# Altium schematic sheet 1V2 Buck Converter.SchDoc: LM27403 1.2V Buck Converter
size Letter; SheetNumber: 3; SheetTotal: 18
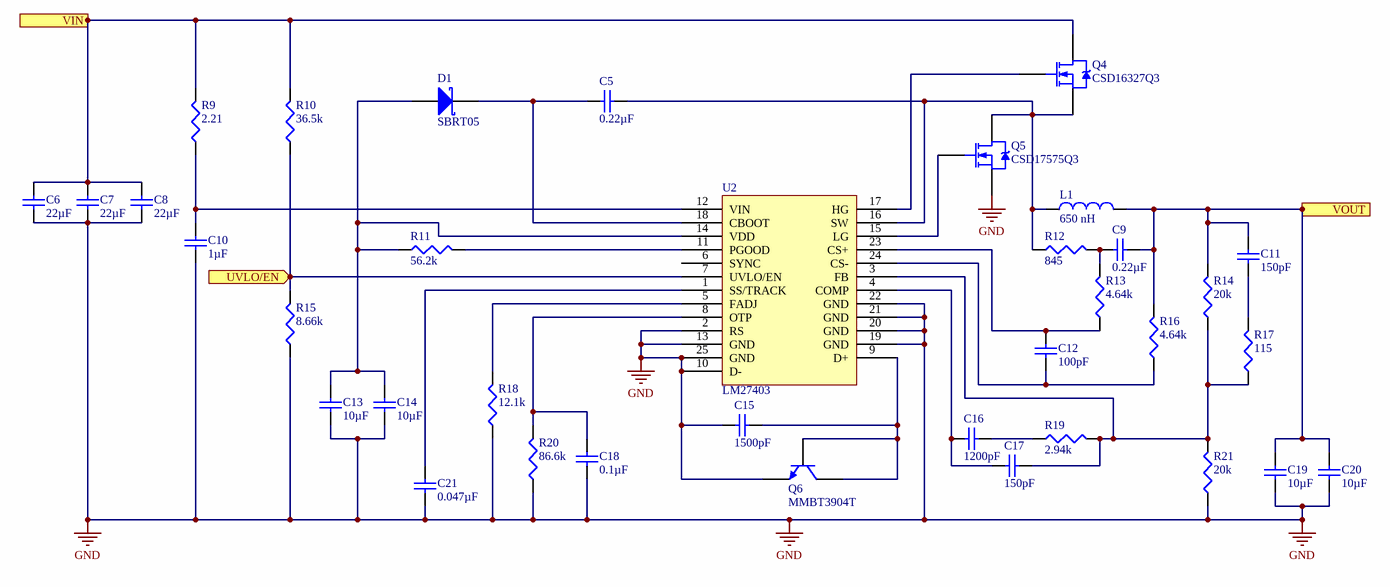
[diagram p0: 1V2 Buck Converter.SchDoc]

## Parts
C5  value 0.22µF  [TY-0402V]  (hidden comment: Cap)
C6  value 22µF  [TY-1210M]  (hidden comment: Cap)
C7  value 22µF  [TY-1210M]  (hidden comment: Cap)
C8  value 22µF  [TY-1210M]  (hidden comment: Cap)
C9  value 0.22µF  [TY-0402V]  (hidden comment: Cap)
C10  value 1µF  [TY-0402V]  (hidden comment: Cap)
C11  value 150pF  [TDK-CGA2B]  (hidden comment: Cap)
C12  value 100pF  [TDK-CGA2B]  (hidden comment: Cap)
C13  value 10µF  [TY-0603A]  (hidden comment: Cap)
C14  value 10µF  [TY-0603A]  (hidden comment: Cap)
C15  value 1500pF  [TDK-CGA2B]  (hidden comment: Cap)
C16  value 1200pF  [KEM-0402BB]  (hidden comment: Cap)
C17  value 150pF  [TDK-CGA2B]  (hidden comment: Cap)
C18  value 0.1µF  [TDK-CGA2B]  (hidden comment: Cap)
C19  value 10µF  [TY-1210M]  (hidden comment: Cap)
C20  value 10µF  [TY-1210M]  (hidden comment: Cap)
C21  value 0.047µF  [TDK-CGA2B]  (hidden comment: Cap)
D1  SBRT05  [DIOD-X2-DFN1006-2]
L1  value 650 nH  [CCI-XAL7070]  (hidden comment: XAL7070-651MEC)
Q4  CSD16327Q3  [TI-Q3]
Q5  CSD17575Q3  [TI-Q3]
Q6  MMBT3904T  [SOT523]
R9  value 2.21  [VSH-0402MCS]  (hidden comment: Res3)
R10  value 36.5k  [PANA-ERA2A]  (hidden comment: Res3)
R11  value 56.2k  [PANA-ERA2A]  (hidden comment: Res3)
R12  value 845  [PANA-ERA2A]  (hidden comment: Res3)
R13  value 4.64k  [PANA-ERJ2R]  (hidden comment: Res3)
R14  value 20k  [PANA-ERJ2R]  (hidden comment: Res3)
R15  value 8.66k  [PANA-ERA2A]  (hidden comment: Res3)
R16  value 4.64k  [PANA-ERJ2R]  (hidden comment: Res3)
R17  value 115  [PANA-ERA2A]  (hidden comment: Res3)
R18  value 12.1k  [PANA-ERA2A]  (hidden comment: Res3)
R19  value 2.94k  [PANA-ERA2A]  (hidden comment: Res3)
R20  value 86.6k  [PANA-ERA2A]  (hidden comment: Res3)
R21  value 20k  [PANA-ERJ2R]  (hidden comment: Res3)
U2  LM27403  [TI-RTW0024A]

## Ports
UVLO/EN (in), VIN (in), VOUT (out)

## Nets
GND: C6.1 C7.1 C8.1 C10.1 C13.1 C14.1 C15.1 C18.1 C19.1 C20.1 C21.1 Q5.3(S) Q6.1(E) R15.1 R18.1 R20.1 R21.1 U2.2(RS) U2.10(D-) U2.13(GND) U2.19(GND) U2.20(GND) U2.21(GND) U2.22(GND) U2.25(GND)
UVLO/EN: R10.1 R15.2 U2.7(UVLO/EN) ; port UVLO/EN
VIN: C6.2 C7.2 C8.2 Q4.2(D) R9.2 R10.2 ; port VIN
VOUT: C9.2 C11.2 C19.2 C20.2 L1.2 R14.2 R16.2 ; port VOUT
NetC5_1: C5.1 D1.2(K) U2.18(CBOOT)
NetC5_2: C5.2 L1.1 Q4.3(S) Q5.2(D) R12.1 U2.16(SW)
NetC9_1: C9.1 R12.2 R13.2
NetC10_2: C10.2 R9.1 U2.12(VIN)
NetC11_1: C11.1 R17.2
NetC12_1: C12.1 R16.1 U2.24(CS-)
NetC12_2: C12.2 R13.1 U2.23(CS+)
NetC13_2: C13.2 C14.2 D1.1(A) R11.1 U2.14(VDD)
NetC15_2: C15.2 Q6.2(B) Q6.3(C) U2.9(D+)
NetC16_1: C16.1 C17.1 U2.4(COMP)
NetC16_2: C16.2 R19.1
NetC17_2: C17.2 R14.1 R17.1 R19.2 R21.2 U2.3(FB)
NetC18_2: C18.2 R20.2 U2.8(OTP)
NetC21_2: C21.2 U2.1(SS/TRACK)
NetQ4_1: Q4.1(G) U2.17(HG)
NetQ5_1: Q5.1(G) U2.15(LG)
NetR11_2: R11.2 U2.11(PGOOD)
NetR18_2: R18.2 U2.5(FADJ)

Not connected (* = marked no-connect by the designer): U2 6(SYNC)

## Notes on the sheet
- (the "License"); you may not use or redistribute this file except in compliance with the License. You
- This file and the information within it are licensed under the terms of the Apache License, Version 2.0
- Copyright
- Unless required by applicable law or agreed to in writing, content distributed under the License is
- distributed on an "AS IS" BASIS, WITHOUT WARRANTIES OR CONDITIONS OF ANY KIND,
- either express or implied. See the License for the specific language governing permissions and
- limitations under the License.
- may obtain a copy of the License at:
- http://www.apache.org/licenses/LICENSE-2.0
- Title
- Size:
- Date:
- Letter
- Number:
- Time:
- Revision:
- Sheet
- of
- University of Alberta
- Deptartment of Electrical
- and Computer Engineering
- Edmonton AB, Canada
- T6G 1H9
- File:

## Library data of the parts
C5 C9 = PC-TY-00301: CAP CER 0.22UF 50V X5R 0402; Manufacturer Part Number: UMK105BJ224KV-F; Index: 301; Designator: C?; Tolerance: ±10%; Published: 2016-03-13; LatestRevisionDate: 2016-03-13; LatestRevisionNote: ...; PackageReference: 0402 (1005 Metric); Publisher: AlbertaSat; PackageDescription: Chip Capacitor, 2-Leads, Body 1.00x0.50mm, IPC Low Density; Part Number: PC-TY-00301; Supplier Part Number 1: 587-3500-1-ND; Supplier 1: Digi-key; Supplier Link: http://www.digikey.ca/product-search/en?keywords=587-3500-1-ND; Voltage-Rated: 50V; Temperature Coefficient: X5R; Application: General Purpose
C6-C8 = PC-TY-00742: CAP CER 22UF 25V X7R 1210; Manufacturer Part Number: TMK325B7226MM-TR; Index: 742; Designator: C?; Tolerance: ±20%; Published: 2016-03-13; LatestRevisionDate: 2016-03-13; LatestRevisionNote: ...; PackageReference: 1210 (3225 Metric); Publisher: AlbertaSat; PackageDescription: Chip Capacitor, 2-Leads, Body 3.20x2.50mm, IPC Low Density; Part Number: PC-TY-00742; Supplier Part Number 1: 587-2784-1-ND; Supplier 1: Digi-key; Supplier Link: http://www.digikey.ca/product-search/en?keywords=587-2784-1-ND; Voltage-Rated: 25V; Temperature Coefficient: X7R; Application: General Purpose
C10 = PC-TY-00381: CAP CER 1UF 25V X5R 0402; Manufacturer Part Number: TMK105BJ105MV-F; Index: 381; Designator: C?; Tolerance: ±20%; Published: 2016-03-13; LatestRevisionDate: 2016-03-13; LatestRevisionNote: ...; PackageReference: 0402 (1005 Metric); Publisher: AlbertaSat; PackageDescription: Chip Capacitor, 2-Leads, Body 1.00x0.50mm, IPC Low Density; Part Number: PC-TY-00381; Supplier Part Number 1: 587-3245-1-ND; Supplier 1: Digi-key; Supplier Link: http://www.digikey.ca/product-search/en?keywords=587-3245-1-ND; Voltage-Rated: 25V; Temperature Coefficient: X5R; Application: General Purpose
C11 C17 = PC-TDK-01264: CAP CER 150PF 50V C0G 0402; Manufacturer Part Number: CGA2B2C0G1H151J050BA; Index: 1264; Designator: C?; Tolerance: ±5%; Temperature Coefficient: NP0; Published: 2016-03-16; LatestRevisionDate: 2016-03-16; LatestRevisionNote: ...; PackageReference: 0402 (1005 Metric); Publisher: AlbertaSat; PackageDescription: Radial Cap, Thru-Hole; 2 Leads; 0.3 in Pin Spacing; Part Number: PC-TDK-01264; Supplier Part Number 1: 445-5598-1-ND; Supplier 1: Digi-key; Supplier Link: http://www.digikey.ca/product-search/en?keywords=445-5598-1-ND; Voltage - Rated: 50V; Applications: Automotive
C12 = PC-TDK-01227: CAP CER 100PF 50V C0G 0402; Manufacturer Part Number: CGA2B2C0G1H101J050BA; Index: 1227; Designator: C?; Tolerance: ±5%; Temperature Coefficient: NP0; Published: 2016-03-16; LatestRevisionDate: 2016-03-16; LatestRevisionNote: ...; PackageReference: 0402 (1005 Metric); Publisher: AlbertaSat; PackageDescription: Radial Cap, Thru-Hole; 2 Leads; 0.3 in Pin Spacing; Part Number: PC-TDK-01227; Supplier Part Number 1: 445-5596-1-ND; Supplier 1: Digi-key; Supplier Link: http://www.digikey.ca/product-search/en?keywords=445-5596-1-ND; Voltage - Rated: 50V; Applications: Automotive
C13 C14 = PC-TY-00593: CAP CER 10UF 16V X5R 0603; Manufacturer Part Number: EMK107BBJ106MA-T; Index: 593; Designator: C?; Tolerance: ±20%; Published: 2016-03-13; LatestRevisionDate: 2016-03-13; LatestRevisionNote: ...; PackageReference: 0603 (1608 Metric); Publisher: AlbertaSat; PackageDescription: Chip Capacitor, 2-Leads, Body 1.60x0.80mm, IPC Low Density; Part Number: PC-TY-00593; Supplier Part Number 1: 587-3238-1-ND; Supplier 1: Digi-key; Supplier Link: http://www.digikey.ca/product-search/en?keywords=587-3238-1-ND; Voltage-Rated: 16V; Temperature Coefficient: X5R; Application: General Purpose
C15 = PC-TDK-01528: CAP CER 1500PF 50V X8R 0402; Manufacturer Part Number: CGA2B2X8R1H152K050BA; Index: 1528; Designator: C?; Tolerance: ±10%; Published: 2016-03-16; LatestRevisionDate: 2016-03-16; LatestRevisionNote: ...; PackageReference: 0402 (1005 Metric); Publisher: AlbertaSat; PackageDescription: Radial Cap, Thru-Hole; 2 Leads; 0.3 in Pin Spacing; Part Number: PC-TDK-01528; Supplier Part Number 1: 445-5880-1-ND; Supplier 1: Digi-key; Supplier Link: http://www.digikey.ca/product-search/en?keywords=445-5880-1-ND; Voltage - Rated: 50V; Temperature Coefficient: X8R; Applications: Automotive
C16 = PC-KEM-01136: CAP CER 1200PF 50V NP0 0402; Manufacturer Part Number: C0402C122J5GACTU; Index: 1136; Designator: C?; Tolerance: ±5%; Published: 2016-03-13; LatestRevisionDate: 2016-03-13; LatestRevisionNote: ...; PackageReference: 0402 (1005 Metric); Publisher: AlbertaSat; PackageDescription: Chip Capacitor, 2-Leads, Body 1.00x0.50mm, IPC Low Density; Part Number: PC-KEM-01136; Supplier Part Number 1: 399-7334-1-ND; Supplier 1: Digi-key; Supplier Link: http://www.digikey.ca/product-search/en?keywords=399-7334-1-ND; Voltage - Rated: 50V; Temperature Coefficient: NP0; Applications: General Purpose
C18 = PC-TDK-02246: CAP CER 0.1UF 10V X5R 0402; Manufacturer Part Number: CGA2B2X5R1A104K050BA; Index: 2246; Designator: C?; Tolerance: ±10%; Published: 2016-03-16; LatestRevisionDate: 2016-03-16; LatestRevisionNote: ...; PackageReference: 0402 (1005 Metric); Publisher: AlbertaSat; PackageDescription: Radial Cap, Thru-Hole; 2 Leads; 0.3 in Pin Spacing; Part Number: PC-TDK-02246; Supplier Part Number 1: 445-12156-1-ND; Supplier 1: Digi-key; Supplier Link: http://www.digikey.ca/product-search/en?keywords=445-12156-1-ND; Voltage - Rated: 10V; Temperature Coefficient: X5R; Applications: Automotive
C19 C20 = PC-TY-00679: CAP CER 10UF 50V X7R 1210; Manufacturer Part Number: UMK325AB7106KM-T; Index: 679; Designator: C?; Tolerance: ±10%; Published: 2016-03-13; LatestRevisionDate: 2016-03-13; LatestRevisionNote: ...; PackageReference: 1210 (3225 Metric); Publisher: AlbertaSat; PackageDescription: Chip Capacitor, 2-Leads, Body 3.20x2.50mm, IPC Low Density; Part Number: PC-TY-00679; Supplier Part Number 1: 587-3167-1-ND; Supplier 1: Digi-key; Supplier Link: http://www.digikey.ca/product-search/en?keywords=587-3167-1-ND; Voltage-Rated: 50V; Temperature Coefficient: X7R; Application: General Purpose
C21 = PC-TDK-02123: CAP CER 0.047UF 25V X7R 0402; Manufacturer Part Number: CGA2B1X7R1E473K050BC; Index: 2123; Designator: C?; Tolerance: ±10%; Published: 2016-03-16; LatestRevisionDate: 2016-03-16; LatestRevisionNote: ...; PackageReference: 0402 (1005 Metric); Publisher: AlbertaSat; PackageDescription: Radial Cap, Thru-Hole; 2 Leads; 0.3 in Pin Spacing; Part Number: PC-TDK-02123; Supplier Part Number 1: 445-5610-1-ND; Supplier 1: Digi-key; Supplier Link: http://www.digikey.ca/product-search/en?keywords=445-5610-1-ND; Voltage - Rated: 25V; Temperature Coefficient: X7R; Applications: Automotive
D1 = 29: SUPER BARRIER RECTIFIER X2-DFN10; Part Number: 29; Manufacturer Part Number: SBRT05U20LPS-7B; Designator: D?; Voltage - Forward (Max): 390mV @ 500mA; Published: 8-Jun-2000; LatestRevisionDate: 17-Jul-2002; LatestRevisionNote: Re-released for DXP Platform.; PackageReference: DFN 0402 (1006 Metric); Publisher: Altium Limited; PackageDescription: DO-214-AA/SMB; 2 C-Bend Leads; Body 5.3 x 3.6 mm, inc. leads (LxW); Code_JEDEC: DO-214-AA; Supplier Part Number 1: SBRT05U20LPS-7BDICT-ND; Supplier 1: Digi-Key; Supplier Part Number 2: 621-SBRT05U20LPS-7B; Supplier 2: Mouser; Supplier Link: #https://www.digikey.ca/products/en?keywords=SBRT05U20LPS-7BDICT-ND#
L1 = PL-CCI-00013: Fixed Inductors 0.65uH 20% 26.5A 1.93mOhms AEC-Q200; Code_IEC: 1005; Index: 13; Designator: L?; Published: 2019-08-06; LatestRevisionDate: 2019-08-06; LatestRevisionNote: ...; PackageReference: CCI-XAL7070; Publisher: AlbertaSat; PackageDescription: Precision Wire Wound Inductor, 2-Leads, Body 7.20x7.50mm, IPC Low Density; Code_JEITA: 0402; Part Number: PL-CCI-00013; Manufacturer Part Number: XAL7070-651MEC; Supplier Part Number 1: 994-XAL7070-651MEC; Supplier 1: Mouser; Supplier Part Number 2: XAL7070-651MEC; Supplier 2: Coilcraft Direct; Supplier Link: #https://www.mouser.ca/ProductDetail/Coilcraft/XAL7070-651MEC?qs=%2Fha2pyFaduhG5%252Ba4CuVa5jFvImje735VGlWzHt6zjMOzK5HnICZz8T3bLeKmdOa2#
Q4 = 62: MOSFET N-CH 25V 60A 8SON; Part Number: 62; Note: Pin 2 is electrically connected to pin 4.; Designator: Q?; Published: 8-Jun-2000; LatestRevisionDate: 17-Jul-2002; LatestRevisionNote: Re-released for DXP Platform.; DatasheetVersion: PD-9.814; PackageVersion: Feb-1997; PackageReference: 8-VSON-CLIP (3.3x3.3); Publisher: Altium Limited; PackageDescription: TO, Thru-Hole, Vertical, Heatsink Mounted; 3 In-Line Leads; Pitch 2.54 mm; ComponentLink1Description: Manufacturer Link; ComponentLink1URL: http://www.irf.com/; Supplier Part Number 2: 595-CSD16327Q3; Supplier 2: Mouser; Manufacturer Part Number: CSD16327Q3; Supplier Part Number 1: 296-30138-1-ND; Supplier 1: Digi-Key; Supplier Link: #https://www.digikey.ca/product-detail/en/texas-instruments/CSD16327Q3/296-30138-1-ND/2811417#; Operating Temperature: -55°C ~ 150°C (TJ)
Q5 = 63: N-Channel 30V 60A (Ta) 2.8W (Ta), 108W (Tc) Surface Mount 8-VSON-CLIP (3.3x3.3); Part Number: 63; Note: Pin 2 is electrically connected to pin 4.; Designator: Q?; Published: 8-Jun-2000; LatestRevisionDate: 17-Jul-2002; LatestRevisionNote: Re-released for DXP Platform.; DatasheetVersion: PD-9.814; PackageVersion: Feb-1997; PackageReference: 8-VSON-CLIP (3.3x3.3); Publisher: Altium Limited; PackageDescription: TO, Thru-Hole, Vertical, Heatsink Mounted; 3 In-Line Leads; Pitch 2.54 mm; ComponentLink1Description: Manufacturer Link; ComponentLink1URL: http://www.irf.com/; Supplier Part Number 2: 595-CSD17575Q3; Supplier 2: Mouser; Manufacturer Part Number: CSD17575Q3; Supplier Part Number 1: 296-39994-1-ND; Supplier 1: Digi-Key; Supplier Link: #https://www.digikey.ca/product-detail/en/texas-instruments/CSD17575Q3/296-39994-1-ND/5177871#; Operating Temperature: -55°C ~ 150°C (TJ)
Q6 = 34: Bipolar (BJT) Transistor NPN 40V 200mA 300MHz 150mW Surface Mount SOT-523; Part Number: 34; Manufacturer Part Number: MMBT3904T-7-F; Designator: Q?; Published: 8-Jun-2000; LatestRevisionDate: 15-Jan-2003; LatestRevisionNote: PCB Footprint 'BCY-W3/D4.7' replaced; DatasheetVersion: 1997; PackageVersion: Sep-1998; PackageReference: SOT523; Publisher: Altium Limited; PackageDescription: TO, Flat Index; 3 In-Line, Axial Leads; Body Dia. 4.5mm; Leads 0.51 x 0.48 mm (max); ComponentLink1Description: Manufacturer Link; ComponentLink1URL: http://www.fairchildsemi.com/; ComponentLink2Description: Datasheet; ComponentLink2URL: http://www.fairchildsemi.com/ds/2N%2F2N3904.pdf; Supplier Part Number 1: MMBT3904T-FDICT-ND; Supplier 1: Digi-Key; Supplier Link: #https://www.digikey.ca/product-detail/en/diodes-incorporated/MMBT3904T-7-F/MMBT3904T-FDICT-ND/725060#
R9 = PR-VSH-00277: RES SMD 2.21 OHM 1% 1/16W 0402; Manufacturer Part Number: CRCW04022R21FKED; Index: 277; Designator: R?; Power - Rated: 0.063W, 1/16W; Temperature Coefficient: ±100ppm/°C; Published: 2019-06-12; LatestRevisionDate: 2019-06-12; LatestRevisionNote: ...; PackageReference: 0402 (1005 Metric); Publisher: AlbertaSat; PackageDescription: 0402 (1005 Metric); Part Number: PR-VSH-00277; Supplier Part Number 1: 541-2.21LLCT-ND; Supplier 1: Digi-key; Supplier Link: https://www.digikey.ca/products/en?keywords=541-2.21LLCT-ND; Tolerance: ±1%
R10 = 18127: RES SMD 36.5KOHM 0.1% 1/16W 0402; Part Number: 18127; Manufacturer Part Number: ERA-2AEB3652X; Designator: R?; Power: 0.063W, 1/16W; Temperature Coefficient: ±25ppm/°C; Published: 8-Jun-2000; LatestRevisionDate: 29-May-2009; LatestRevisionNote: IPC-7351 Footprint Added.; PackageReference: 0402 (1005 Metric); Publisher: Altium Limited; PackageDescription: Chip Resistor, 2-Leads, Body 1.00x0.50mm, IPC Low Density; Supplier Part Number 1: P36.5KDCCT-ND; Supplier 1: Digi-Key; Supplier Link: http://www.digikey.ca/product-search/en?keywords=P36.5KDCCT-ND; Tolerance: ±0.1%
R11 = 18410: RES SMD 56.2KOHM 0.1% 1/16W 0402; Part Number: 18410; Manufacturer Part Number: ERA-2AEB5622X; Designator: R?; Power: 0.063W, 1/16W; Temperature Coefficient: ±25ppm/°C; Published: 8-Jun-2000; LatestRevisionDate: 29-May-2009; LatestRevisionNote: IPC-7351 Footprint Added.; PackageReference: 0402 (1005 Metric); Publisher: Altium Limited; PackageDescription: Chip Resistor, 2-Leads, Body 1.00x0.50mm, IPC Low Density; Supplier Part Number 1: P56.2KDCCT-ND; Supplier 1: Digi-Key; Supplier Link: http://www.digikey.ca/product-search/en?keywords=P56.2KDCCT-ND; Tolerance: ±0.1%
R12 = 15295: RES SMD 845 OHM 0.1% 1/16W 0402; Part Number: 15295; Manufacturer Part Number: ERA-2AEB8450X; Designator: R?; Power: 0.063W, 1/16W; Temperature Coefficient: ±25ppm/°C; Published: 8-Jun-2000; LatestRevisionDate: 29-May-2009; LatestRevisionNote: IPC-7351 Footprint Added.; PackageReference: 0402 (1005 Metric); Publisher: Altium Limited; PackageDescription: Chip Resistor, 2-Leads, Body 1.00x0.50mm, IPC Low Density; Supplier Part Number 1: P845DCCT-ND; Supplier 1: Digi-Key; Supplier Link: http://www.digikey.ca/product-search/en?keywords=P845DCCT-ND; Tolerance: ±0.1%
R13 R16 = 16643: RES SMD 4.64K OHM 1% 1/10W 0402; Part Number: 16643; Manufacturer Part Number: ERJ-2RKF4641X; Designator: R?; Power: 0.1W, 1/10W; Temperature Coefficient: ±100ppm/°C; Published: 8-Jun-2000; LatestRevisionDate: 29-May-2009; LatestRevisionNote: IPC-7351 Footprint Added.; PackageReference: 0402 (1005 Metric); Publisher: Altium Limited; PackageDescription: Chip Resistor, 2-Leads, Body 1.00x0.50mm, IPC Low Density; Supplier Part Number 1: P4.64KLCT-ND; Supplier 1: Digi-Key; Supplier Link: http://www.digikey.ca/product-search/en?keywords=P4.64KLCT-ND; Tolerance: ±1%
R14 R21 = 17706: RES SMD 20K OHM 1% 1/10W 0402; Part Number: 17706; Manufacturer Part Number: ERJ-2RKF2002X; Designator: R?; Power: 0.1W, 1/10W; Temperature Coefficient: ±100ppm/°C; Published: 8-Jun-2000; LatestRevisionDate: 29-May-2009; LatestRevisionNote: IPC-7351 Footprint Added.; PackageReference: 0402 (1005 Metric); Publisher: Altium Limited; PackageDescription: Chip Resistor, 2-Leads, Body 1.00x0.50mm, IPC Low Density; Supplier Part Number 1: P20.0KLCT-ND; Supplier 1: Digi-Key; Supplier Link: http://www.digikey.ca/product-search/en?keywords=P20.0KLCT-ND; Tolerance: ±1%
R15 = 17100: RES SMD 8.66KOHM 0.1% 1/16W 0402; Part Number: 17100; Manufacturer Part Number: ERA-2AEB8661X; Designator: R?; Power: 0.063W, 1/16W; Temperature Coefficient: ±25ppm/°C; Published: 8-Jun-2000; LatestRevisionDate: 29-May-2009; LatestRevisionNote: IPC-7351 Footprint Added.; PackageReference: 0402 (1005 Metric); Publisher: Altium Limited; PackageDescription: Chip Resistor, 2-Leads, Body 1.00x0.50mm, IPC Low Density; Supplier Part Number 1: P8.66KDCCT-ND; Supplier 1: Digi-Key; Supplier Link: http://www.digikey.ca/product-search/en?keywords=P8.66KDCCT-ND; Tolerance: ±0.1%
R17 = 14144: RES SMD 115 OHM 0.1% 1/16W 0402; Part Number: 14144; Manufacturer Part Number: ERA-2AEB1150X; Designator: R?; Power: 0.063W, 1/16W; Temperature Coefficient: ±25ppm/°C; Published: 8-Jun-2000; LatestRevisionDate: 29-May-2009; LatestRevisionNote: IPC-7351 Footprint Added.; PackageReference: 0402 (1005 Metric); Publisher: Altium Limited; PackageDescription: Chip Resistor, 2-Leads, Body 1.00x0.50mm, IPC Low Density; Supplier Part Number 1: P115DCCT-ND; Supplier 1: Digi-Key; Supplier Link: http://www.digikey.ca/product-search/en?keywords=P115DCCT-ND; Tolerance: ±0.1%
R18 = 17334: RES SMD 12.1KOHM 0.1% 1/16W 0402; Part Number: 17334; Manufacturer Part Number: ERA-2AEB1212X; Designator: R?; Power: 0.063W, 1/16W; Temperature Coefficient: ±25ppm/°C; Published: 8-Jun-2000; LatestRevisionDate: 29-May-2009; LatestRevisionNote: IPC-7351 Footprint Added.; PackageReference: 0402 (1005 Metric); Publisher: Altium Limited; PackageDescription: Chip Resistor, 2-Leads, Body 1.00x0.50mm, IPC Low Density; Supplier Part Number 1: P12.1KDCCT-ND; Supplier 1: Digi-Key; Supplier Link: http://www.digikey.ca/product-search/en?keywords=P12.1KDCCT-ND; Tolerance: ±0.1%
R19 = 16271: RES SMD 2.94KOHM 0.1% 1/16W 0402; Part Number: 16271; Manufacturer Part Number: ERA-2AEB2941X; Designator: R?; Power: 0.063W, 1/16W; Temperature Coefficient: ±25ppm/°C; Published: 8-Jun-2000; LatestRevisionDate: 29-May-2009; LatestRevisionNote: IPC-7351 Footprint Added.; PackageReference: 0402 (1005 Metric); Publisher: Altium Limited; PackageDescription: Chip Resistor, 2-Leads, Body 1.00x0.50mm, IPC Low Density; Supplier Part Number 1: P2.94KDCCT-ND; Supplier 1: Digi-Key; Supplier Link: http://www.digikey.ca/product-search/en?keywords=P2.94KDCCT-ND; Tolerance: ±0.1%
R20 = 18660: RES SMD 86.6KOHM 0.1% 1/16W 0402; Part Number: 18660; Manufacturer Part Number: ERA-2AEB8662X; Designator: R?; Power: 0.063W, 1/16W; Temperature Coefficient: ±25ppm/°C; Published: 8-Jun-2000; LatestRevisionDate: 29-May-2009; LatestRevisionNote: IPC-7351 Footprint Added.; PackageReference: 0402 (1005 Metric); Publisher: Altium Limited; PackageDescription: Chip Resistor, 2-Leads, Body 1.00x0.50mm, IPC Low Density; Supplier Part Number 1: P86.6KDCCT-ND; Supplier 1: Digi-Key; Supplier Link: http://www.digikey.ca/product-search/en?keywords=P86.6KDCCT-ND; Tolerance: ±0.1%
U2 = 61: Buck Regulator Positive Output Step-Down  DC-DC Controller IC 24-WQFN (4x4); Part Number: 61; Supplier Part Number 2: 595-LM27403SQ/NOPB; Supplier 2: Mouser; Manufacturer Part Number: LM27403SQ/NOPB; Supplier Part Number 1: 296-37015-1-ND; Supplier 1: Digi-Key; Supplier Link: https://www.digikey.ca/product-detail/en/texas-instruments/LM27403SQ-NOPB/296-37015-1-ND/4430488; PackageReference: 24-WFQFN Exposed Pad; Operating Temperature: -40°C ~ 125°C (TJ)